# Altium schematic sheet RC_Transmit_SCH.SchDoc
size A
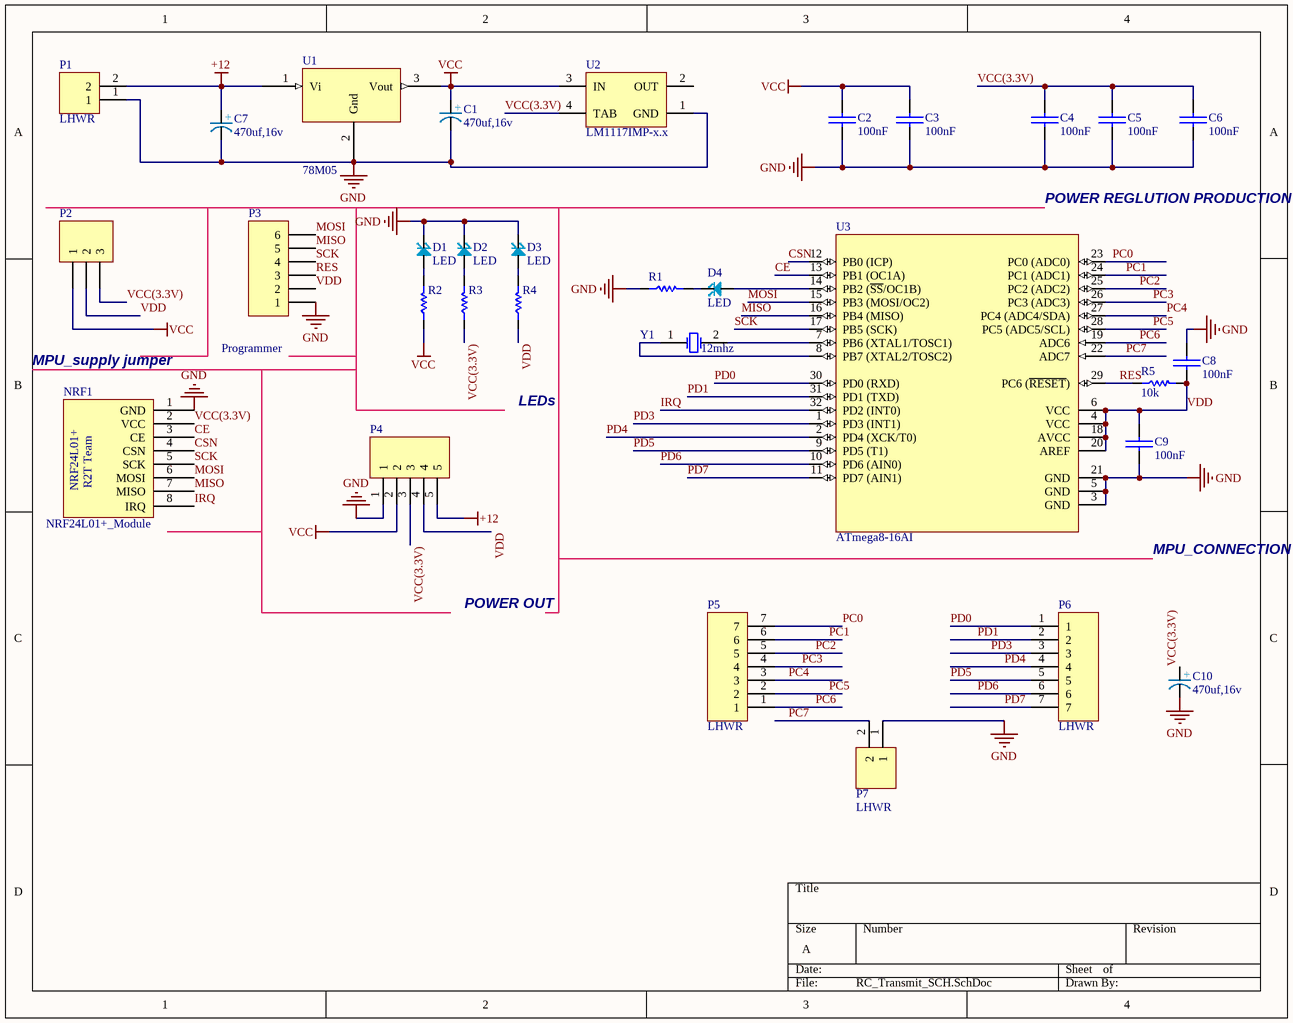
[diagram p0: RC_Transmit_SCH.SchDoc]

## Parts
C1  Description:: 470uf,16v  [Electrolytic Capacitor SMD Dia-8]  (hidden comment: Capacitor Polarized)
C2  100nF  [SMD_CAP_1206]
C3  100nF  [SMD_CAP_1206]
C4  100nF  [SMD_CAP_1206]
C5  100nF  [SMD_CAP_1206]
C6  100nF  [SMD_CAP_1206]
C7  Description:: 470uf,16v  [Electrolytic Capacitor SMD Dia-8]  (hidden comment: Capacitor Polarized)
C8  100nF  [SMD_CAP_1206]
C9  100nF  [SMD_CAP_1206]
C10  Description:: 470uf,16v  [Electrolytic Capacitor SMD Dia-8]  (hidden comment: Capacitor Polarized)
D1  LED  [LED_5MM]
D2  LED  [LED_5MM]
D3  LED  [LED_5MM]
D4  LED  [LED_5MM]
NRF1  NRF24L01+_Module  [NRF24L01+_Module]
P1  LHWR  [Polarized Header 2]
P2  Header 3  [HDR1X3]  (value not drawn)
P3  Programmer  [HDR1X6]
P4  LHWR  [Polarized Header 5]  (value not drawn)
P5  LHWR  [Polarized Header 7]
P6  LHWR  [Polarized Header 7]
P7  LHWR  [Polarized Header 2]
R1  125/100  [RES 0805 (2012X06L)]  (value not drawn)
R2  100/125  [RES 0805 (2012X06L)]  (value not drawn)
R3  100/125  [RES 0805 (2012X06L)]  (value not drawn)
R4  100/125  [RES 0805 (2012X06L)]  (value not drawn)
R5  10k  [RES 0805 (2012X06L)]
U1  78M05  [DPAK228P972X240-3N]
U2  LM1117IMP-x.x  [MP04A_N]
U3  ATmega8-16AI  [My_32A_M]
Y1  12mhz  [XTAL Small]

## Nets
+12: C7.1 P1.2 P4.5 U1.1(Vi)
GND: C1.2 C2.2(-) C3.2(-) C4.2(-) C5.2(-) C6.2(-) C7.2 C8.2(-) C9.2(-) C10.2 D1.2 D2.2 D3.2 NRF1.1(GND) P1.1 P3.1 P4.1 P7.1 R1.1 U1.2(Gnd) U2.1(GND) U3.3(GND) U3.5(GND) U3.21(GND)
VCC: C1.1 C2.1(+) C3.1(+) P2.1 P4.2 R2.1 U1.3(Vout) U2.3(IN)
CE: NRF1.3(CE) U3.13(PB1_(OC1A))
CSN: NRF1.4(CSN) U3.12(PB0_(ICP))
IRQ: NRF1.8(IRQ) U3.32(PD2_(INT0))
MISO: NRF1.7(MISO) P3.5 U3.16(PB4_(MISO))
MOSI: NRF1.6(MOSI) P3.6 U3.15(PB3_(MOSI/OC2))
PC0: P5.7 U3.23(PC0_(ADC0))
PC1: P5.6 U3.24(PC1_(ADC1))
PC2: P5.5 U3.25(PC2_(ADC2))
PC3: P5.4 U3.26(PC3_(ADC3))
PC4: P5.3 U3.27(PC4_(ADC4/SDA))
PC5: P5.2 U3.28(PC5_(ADC5/SCL))
PC6: P5.1 U3.19(ADC6)
PC7: P7.2 U3.22(ADC7)
PD0: P6.1 U3.30(PD0_(RXD))
PD1: P6.2 U3.31(PD1_(TXD))
PD3: P6.3 U3.1(PD3_(INT1))
PD4: P6.4 U3.2(PD4_(XCK/T0))
PD5: P6.5 U3.9(PD5_(T1))
PD6: P6.6 U3.10(PD6_(AIN0))
PD7: P6.7 U3.11(PD7_(AIN1))
RES: P3.3 R5.1 U3.29(PC6_(~{RESET}))
SCK: NRF1.5(SCK) P3.4 U3.17(PB5_(SCK))
VCC(3.3V): C4.1(+) C5.1(+) C6.1(+) C10.1 NRF1.2(VCC) P2.3 P4.3 R3.1 U2.4(TAB)
VDD: C8.1(+) C9.1(+) P2.2 P3.2 P4.4 R4.1 R5.2 U3.4(VCC) U3.6(VCC) U3.18(AVCC) U3.20(AREF)
NetD1_1: D1.1 R2.2
NetD2_1: D2.1 R3.2
NetD3_1: D3.1 R4.2
NetD4_1: D4.1 U3.14(PB2_(~{SS}/OC1B))
NetD4_2: D4.2 R1.2
NetU3_7: U3.7(PB6_(XTAL1/TOSC1)) Y1.2(OSC2)
NetU3_8: U3.8(PB7_(XTAL2/TOSC2)) Y1.1(OSC1)

Not connected (* = marked no-connect by the designer): U2 2(OUT)

## Notes on the sheet
- POWER REGLUTION PRODUCTION
- (near NRF1) MPU_supply jumper
- LEDs
- MPU_CONNECTION
- POWER OUT
- (in symbol Capacitor Polarized) +
- (in symbol NRF24L01+_Module) NRF24L01+; R2T Team

## Library data of the parts
C1 C7 C10 = Capacitor Polarized: Designer: Hamed Jafarzadeh ( R2T )
C2-C6 C8 C9 = Cap-Bipolar: Bipolar Capacitor; Voltage: 100V; Designer: Saeid Jorablo; Organazation: ControTec; Adding Date: 1387/12/20; Value: 100nF
NRF1 = NRF24L01+_Module: Designer:: HamedJafarzadeh
P1 P7 = 2pin LHWR: Designer:: Hamed Jafarzadeh - www.R2T.ir
P2 = Header 3: Header, 3-Pin; LatestRevisionDate: 17-Jul-2002; LatestRevisionNote: Re-released for DXP Platform.; Publisher: Altium Limited
P3 = Header 6: Header, 6-Pin; LatestRevisionDate: 17-Jul-2002; LatestRevisionNote: Re-released for DXP Platform.; Publisher: Altium Limited
P4 = 5pin LHWR: Designer:: Hamed Jafarzadeh - www.R2T.ir
P5 P6 = 7pin LHWR: Designer:: Hamed Jafarzadeh - www.R2T.ir
R1-R4 = Resistor: Tolerance: 5%; Power: 1/8 W
  R1: Value: 125/100
  R2-R4: Value: 100/125
R5 = Resistor: Value: 10k
U2 = LM1117IMP-x.x: x.x Volt, 800mA Low-Dropout Linear Regulator, 4-pin SOT-223; PartNumber: LM1117IMP-3.3; Manufacturer: National Semiconductor; PackageTopMarking: XYTT*N05B; PowerWise: N; CompType: LDO IC; Published: 4-Dec-2008; DatasheetVersion: Apr-2006; PackageVersion: revB, Apr-2003; PackageReference: MP04A; Publisher: Altium Limited; PackageDescription: Molded SOT-223, 6.50 x 3.56 x 1.6mm Body, 4 Lead, 2.3mm Pitch; Supplier 1: Farnell; Supplier Part Number 1: 7614123; RoHS: N; PinCount: 4; Code_JEDEC: TO-261-AA; Code_IPC: SOT223-4; ComponentLink1Description: LM1117 Datasheet; ComponentLink1URL: http://www.national.com/ds/LM/LM1117.pdf; ComponentLink2Description: LM1117 Web Page; ComponentLink2URL: http://www.national.com/pf/LM/LM1117.html; ComponentLink3Description: MP04A Package Page; ComponentLink3URL: http://www.national.com/packaging/folders/mp04a.html
U3 = ATmega8-16AI: AVR 8K Bytes of In-System Programmable Flash Memory; Published: 17-Sep-2003; LatestRevisionDate: 13-Apr-2006; LatestRevisionNote: IPC-7351 Footprint Added.; DatasheetVersion: 2486H-AVR-09/02; PackageVersion: revB, Oct-2001; PackageReference: 32A; Publisher: Altium Limited; PackageDescription: 32-Pin Thin Quad Flat Pack 0.8 mm Pitch; Code_JEDEC: MS-026-ABA; ComponentLink1Description: Manufacturer Link; ComponentLink1URL: http://www.atmel.com; ComponentLink2Description: Datasheet; ComponentLink2URL: http://www.atmel.com/dyn/resources/prod_documents/doc2486.pdf
Y1 = XTAL: XTAL Crystal; Company: E.P.I.L; Design Date: 11/04/2011; Value: 12mhz